# EasyEDA Pro project PCB.epro, schematic Schematic1_3
Board Name: Board1; Create Date: 2026-03-31; Page Name: P1; Project Name: ID PCB1; Schematic Name: Schematic1; Update Date: 2026-04-01; Company: EasyEDA.com; Page Size: A4; Version: V1.0
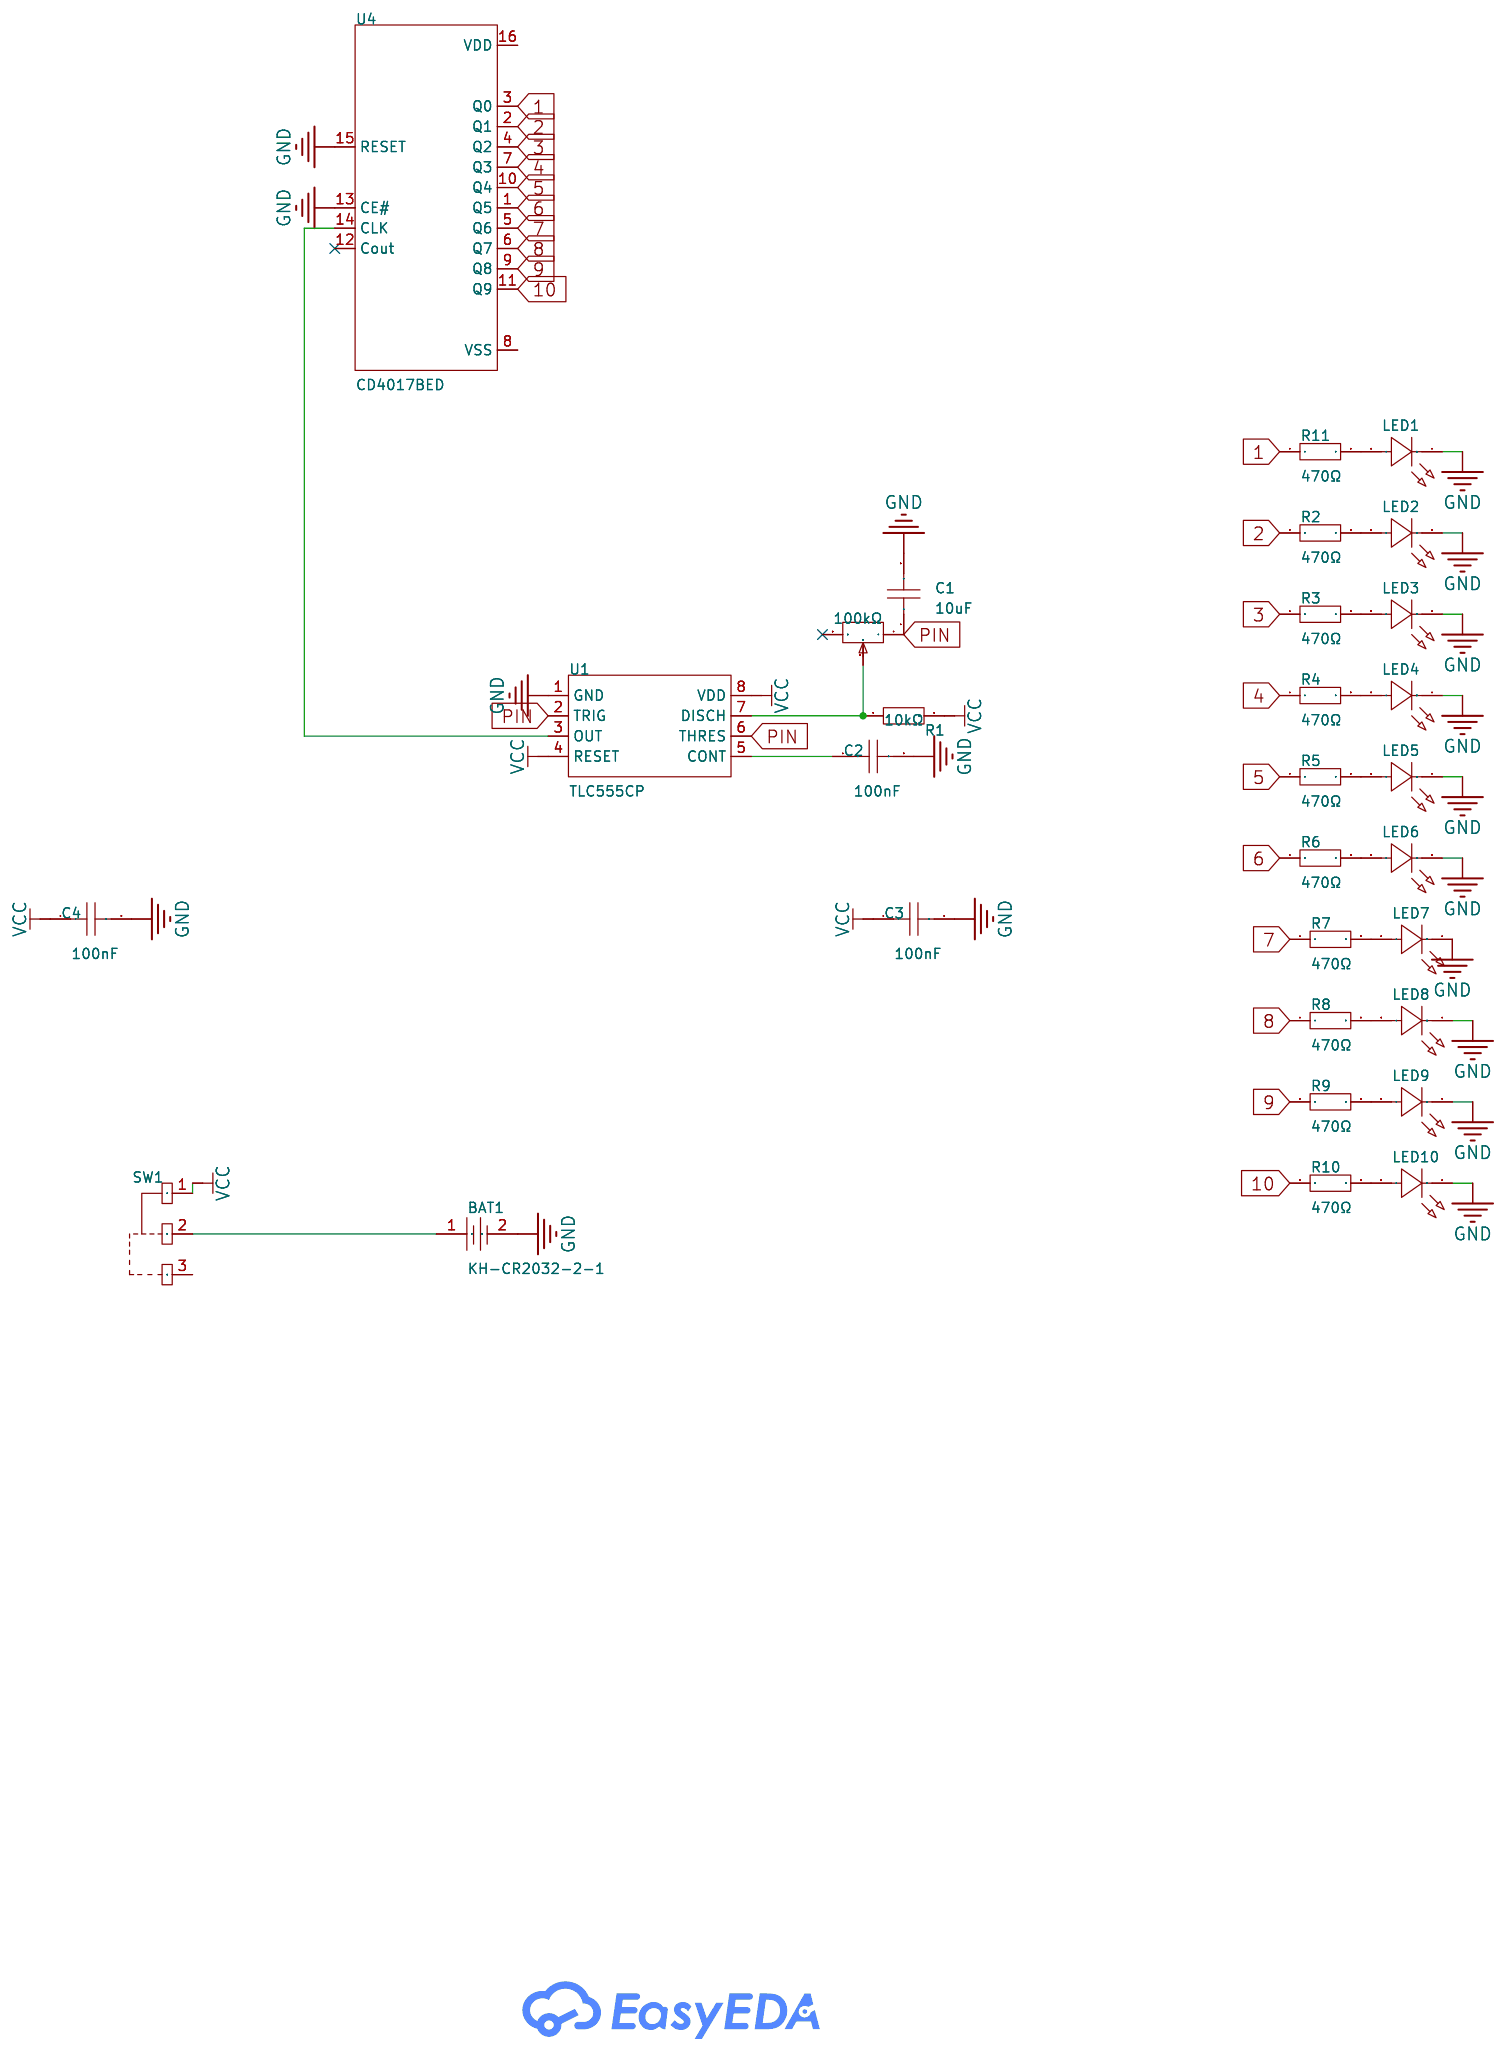
[diagram p3: schematic sheet]

## Parts
BAT1  KH-CR2032-2-1  [BAT-TH_KH-CR2032-2-1]
C1  10uF  [C0603]
C2  100nF  [C0603]
C3  100nF  [C0603]
C4  100nF  [C0603]
LED1  YLED0603Y  [LED0603-RD-1]
LED2  YLED0603Y  [LED0603-RD-1]
LED3  YLED0603Y  [LED0603-RD-1]
LED4  YLED0603Y  [LED0603-RD-1]
LED5  YLED0603Y  [LED0603-RD-1]
LED6  YLED0603Y  [LED0603-RD-1]
LED7  YLED0603Y  [LED0603-RD-1]
LED8  YLED0603Y  [LED0603-RD-1]
LED9  YLED0603Y  [LED0603-RD-1]
LED10  YLED0603Y  [LED0603-RD-1]
R1  10kΩ  [R0603]
R2  470Ω  [R0603]
R3  470Ω  [R0603]
R4  470Ω  [R0603]
R5  470Ω  [R0603]
R6  470Ω  [R0603]
R7  470Ω  [R0603]
R8  470Ω  [R0603]
R9  470Ω  [R0603]
R10  470Ω  [R0603]
R11  470Ω  [R0603]
SW1  MST-12D18G2 SMD Slide Switch  [SW-SMD_3P-L9.1-W3.5-P2.50_MST-12D18G2]
U1  TLC555CP  [DIP-8_L9.7-W6.4-P2.54-LS7.6-BL]
U2  100kΩ  [RES-ADJ-SMD_RM065-V1]
U4  CD4017BED  [PDIP-16_L19.7-W6.6-P2.54-LS7.6-BL]

## Library data of the parts
BAT1 = KH-CR2032-2-1: Supplier Part: C5365915; Manufacturer: kinghelm(金航标); Datasheet: https://atta.szlcsc.com/upload/public/pdf/source/20230301/F3ED62C53898C1F99BC47B7A2E148BA2.pdf; Supplier: LCSC
C1 = CL10A106KP8NNNC: Capacitance:10uF Tolerance:±10% Tolerance:±10% Voltage Rating:10V Temperature Coefficient:X5R; LCSC Part Name: 10uF ±10% 10V; Supplier Part: C19702; Manufacturer: SAMSUNG(三星); Supplier Footprint: 0603; Datasheet: https://item.szlcsc.com/datasheet/CL10A106KP8NNNC/20411.html; Supplier: LCSC; Tolerance: ±10%; Voltage Rating: 10V; Temperature Coefficient: X5R
C2-C4 = CC0603KRX7R9BB104: Capacitance:100nF Tolerance:±10% Tolerance:±10% Voltage Rating:50V Temperature Coefficient:X7R; LCSC Part Name: 100nF ±10% 50V; Supplier Part: C14663; Manufacturer: YAGEO(国巨); Supplier Footprint: 0603; JLCPCB Part Class: Basic Part; Datasheet: https://item.szlcsc.com/datasheet/CC0603KRX7R9BB104/15331.html; Supplier: LCSC; Tolerance: ±10%; Voltage Rating: 50V; Temperature Coefficient: X7R
LED1-LED10 = YLED0603Y: Lamp Holder Type:- Illumination Color:Yellow Voltage - Forward(Vf):1.8V~2.4V Voltage - Forward(Vf):1.8V~2.4V Power(Watts):- Forward Current:30mA Wavelength - Dominant:585nm~595nm Wavelength - Dominant:585nm~595nm Peak Wavelength:- Diode Configuration:Disc; LCSC Part Name: 黄色 独立二极管; Supplier Part: C19273152; Manufacturer: YONGYUTAI(永裕泰); Supplier Footprint: 0603; JLCPCB Part Class: Extended Part; Datasheet: https://item.szlcsc.com/datasheet/YLED0603Y/20555406.html; Supplier: LCSC; Illumination Color: Yellow; Voltage - Forward(Vf): 1.8V~2.4V; Forward Current: 30mA; Wavelength - Dominant: 585nm~595nm; Diode Configuration: Discrete Diode; Luminous Intensity: 144mcd; Viewing Angle: 120°; Operating Temperature: -40℃~+85℃
R1 = RC0603FR-0710KL: Type:Thick Film Resistors Resistance: Tolerance:±1% Tolerance:±1% Power(Watts): Overload Voltage (Max): Temperature Coefficient:±100ppm/℃ Temperature Coefficient:±100ppm/℃ Operating Temperature Range:-55℃~+155℃ Operating Temperature Range:-55℃~+155℃; LCSC Part Name: 厚膜电阻 10kΩ ±1% 100mW; Supplier Part: C98220; Manufacturer: YAGEO(国巨); Supplier Footprint: 0603; JLCPCB Part Class: Extended Part; Datasheet: https://atta.szlcsc.com/upload/public/pdf/source/20180927/C295883_E8D83085EA81BD7DE0B2B681138C15EE.pdf; Supplier: LCSC; Type: Thick Film Resistors; Tolerance: ±1%; Temperature Coefficient: ±100ppm/℃; Operating Temperature Range: -55℃~+155℃
R2-R11 = 0603WAF4700T5E: Type:Thick Film Resistor Resistance:470Ω Tolerance:±1% Tolerance:±1% Power(Watts):100mW Voltage-Supply(Max):75V Temperature Coefficient:±100ppm/℃ Temperature Coefficient:±100ppm/℃ Operating Temperature:-55℃~+155℃ Operating Temperature:-55℃~+155℃; LCSC Part Name: 470Ω ±1% 100mW 厚膜电阻; Supplier Part: C23179; Manufacturer: UNI-ROYAL(厚声); Supplier Footprint: 0603; Datasheet: https://item.szlcsc.com/datasheet/0603WAF4700T5E/23906.html; Supplier: LCSC; Type: Thick Film Resistor; Tolerance: ±1%; Power(Watts): 100mW; Voltage-Supply(Max): 75V; Temperature Coefficient: ±100ppm/℃; Operating Temperature: -55℃~+155℃
SW1 = MST-12D18G2 SMD Slide Switch: Circuit:SPDT Actuator Style:Rectangular Columnar Termination Style:SMD(SMT) Tab Length:9.1mm Width:3.5mm Switch Height:5.5mm Mounting Type:Surface Mount, Right Angle Actuator Color:Black Current Rating:100mA Voltage Rating:12V Life:10,000 Cycles Operating; LCSC Part Name: MST-12D18G2卧式带柱编带; Supplier Part: C49023765; Manufacturer: SHOU HAN(首韩); Supplier Footprint: SMD; JLCPCB Part Class: Extended Part; Datasheet: https://item.szlcsc.com/datasheet/MST-12D18G2%2520SMD%2520Slide%2520Switch/51384140.html; Supplier: LCSC; Circuit: SPDT; Actuator Style: Rectangular Columnar; Termination Style: SMD(SMT) Tab; Length: 9.1mm; Width: 3.5mm; Switch Height: 5.5mm; Mounting Type: Surface Mount, Right Angle; Actuator Color: Black; Current Rating: 100mA; Voltage Rating: 12V; Life: 10,000 Cycles; Operating Temperature: -25℃~+70℃
U1 = TLC555CP: Supplier Part: C910886; Manufacturer: TI(德州仪器); Supplier Footprint: PDIP-8; Datasheet: https://www.ti.com/cn/lit/gpn/tlc555; Supplier: LCSC
U2 = RM065-104(100K): Resistance:100kΩ Tolerance:±25% Tolerance:±25% Voltage Rating:50V Power(Watts):100mW; LCSC Part Name: 100kΩ ±25%; Supplier Part: C5205024; Manufacturer: BOCHEN(博晨); Supplier Footprint: 插件,7.3x6.4mm; JLCPCB Part Class: Extended Part; Datasheet: https://item.szlcsc.com/datasheet/RM065-104(100K)/5896382.html; Supplier: LCSC; Tolerance: ±25%; Voltage Rating: 50V; Power(Watts): 100mW
U4 = CD4017BED: Supplier Part: C51898328; Manufacturer: GMIC(绿微); Supplier Footprint: DIP-16; JLCPCB Part Class: Extended Part; Datasheet: https://item.szlcsc.com/datasheet/CD4017BED/54583753.html; Supplier: LCSC

## Nets
GND: BAT1.2 C1.2 C2.2 C3.2 C4.2 LED1.1(C) LED2.1(C) LED3.1(C) LED4.1(C) LED5.1(C) LED6.1(C) LED7.1(C) LED8.1(C) LED9.1(C) LED10.1(C) U1.1(GND) U4.13(CE#) U4.15(RESET)
VCC: C3.1 C4.1 R1.2 SW1.1 U1.4(RESET) U1.8(VDD)
1: R11.1 U4.3(Q0)
2: R2.1 U4.2(Q1)
3: R3.1 U4.4(Q2)
4: R4.1 U4.7(Q3)
5: R5.1 U4.10(Q4)
6: R6.1 U4.1(Q5)
7: R7.1 U4.5(Q6)
8: R8.1 U4.6(Q7)
9: R9.1 U4.9(Q8)
10: R10.1 U4.11(Q9)
PIN: C1.1 U1.2(TRIG) U1.6(THRES) U2.1
$1N11512: R1.1 U1.7(DISCH) U2.2
$1N11976: U1.3(OUT) U4.14(CLK)
$1N14501: C2.1 U1.5(CONT)
$1N14987: BAT1.1 SW1.2
$1N17110: LED1.2(A) R11.2
$1N17152: LED2.2(A) R2.2
$1N17194: LED3.2(A) R3.2
$1N17236: LED4.2(A) R4.2
$1N17278: LED5.2(A) R5.2
$1N17320: LED6.2(A) R6.2
$1N17362: LED7.2(A) R7.2
$1N17404: LED8.2(A) R8.2
$1N17446: LED9.2(A) R9.2
$1N17488: LED10.2(A) R10.2

Not connected (* = marked no-connect by the designer): SW1 3; U2 3*; U4 8(VSS) 12(Cout)* 16(VDD)
